# Altium schematic sheet RaspberryPi.SchDoc
size A4
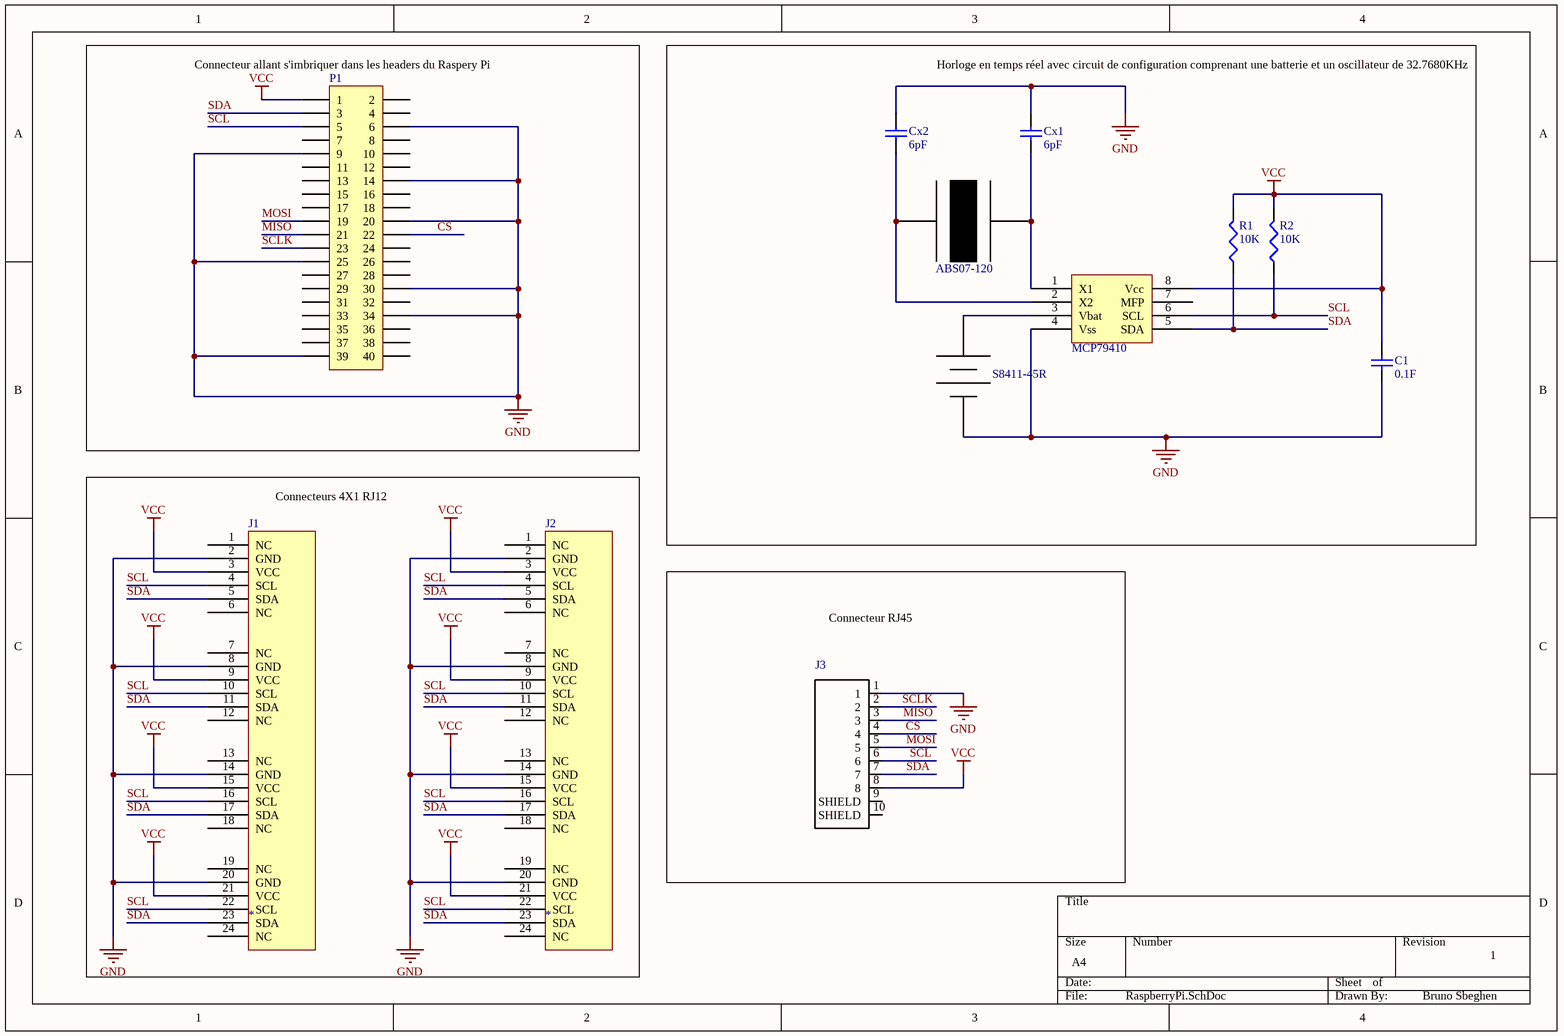
[diagram p0: RaspberryPi.SchDoc]

## Parts
ABS07-120  *  [ECX-31B]  (value not drawn)
C1  value 0.1F  [C0805]  (hidden comment: Cap 0.1uF)
Cx1  value 6pF  [C0805]  (hidden comment: Cap 6pF)
Cx2  value 6pF  [C0805]  (hidden comment: Cap 6pF)
J1  *  [TM2RE-2424]
J2  *  [TM2RE-2424]
J3  RJ45-8N-B  [TE_RJ45-8N-B]  (value not drawn)
MCP79410  *  [MCP79410]  (value not drawn)
P1  Header 20X2  [HDR2X20]  (value not drawn)
R1  value 10K  [6-0805_N]  (hidden comment: Res 10K)
R2  value 10K  [6-0805_N]  (hidden comment: Res 10K)
S8411-45R  *  [S8411-45R]  (value not drawn)

## Blocks framed on the sheet
Connecteur allant s'imbriquer dans les headers du Raspery Pi: P1
Connecteurs 4X1 RJ12: J1 J2
Connecteur RJ45: J3

## Nets
GND: C1.1 Cx1.2 Cx2.2 J1.2(GND) J1.8(GND) J1.14(GND) J1.20(GND) J2.2(GND) J2.8(GND) J2.14(GND) J2.20(GND) J3.1 MCP79410.4(Vss) P1.6 P1.9 P1.14 P1.20 P1.25 P1.30 P1.34 P1.39 S8411-45R.1
VCC: C1.2 J1.3(VCC) J1.9(VCC) J1.15(VCC) J1.21(VCC) J2.3(VCC) J2.9(VCC) J2.15(VCC) J2.21(VCC) J3.8 MCP79410.8(Vcc) P1.1 R1.2 R2.2
CS: J3.4 P1.22
MISO: J3.3 P1.21
MOSI: J3.5 P1.19
SCL: J1.4(SCL) J1.10(SCL) J1.16(SCL) J1.22(SCL) J2.4(SCL) J2.10(SCL) J2.16(SCL) J2.22(SCL) J3.6 MCP79410.6(SCL) P1.5 R2.1
SCLK: J3.2 P1.23
SDA: J1.5(SDA) J1.11(SDA) J1.17(SDA) J1.23(SDA) J2.5(SDA) J2.11(SDA) J2.17(SDA) J2.23(SDA) J3.7 MCP79410.5(SDA) P1.3 R1.1
NetABS07-120_1: ABS07-120.1 Cx2.1 MCP79410.2(X2)
NetABS07-120_2: ABS07-120.2 Cx1.1 MCP79410.1(X1)
NetMCP79410_3: MCP79410.3(Vbat) S8411-45R.2

Not connected (* = marked no-connect by the designer): J1 1(NC) 6(NC) 7(NC) 12(NC) 13(NC) 18(NC) 19(NC) 24(NC); J2 1(NC) 6(NC) 7(NC) 12(NC) 13(NC) 18(NC) 19(NC) 24(NC); J3 9(SHIELD) 10(SHIELD); MCP79410 7(MFP); P1 2 4 7 8 10 11 12 13 15 16 17 18 24 26 27 28 29 31 32 33 35 36 37 38 40

## Notes on the sheet
- Horloge en temps réel avec circuit de configuration comprenant une batterie et un oscillateur de 32.7680KHz
- 1
- Bruno Sbeghen

## Library data of the parts
ABS07-120 = AB38T: Oscillator 32.7680KHz; Supplier 1: Digi-Key; Supplier Part Number 1: 535-11937-1-ND
C1 = Cap 0.1uF: Capacitor 0.1uF; Published: 8-Jun-2000; LatestRevisionDate: 29-May-2009; LatestRevisionNote: IPC-7351 Footprint Added.; PackageReference: C1206; Publisher: Altium Limited; PackageDescription: Chip Capacitor; Supplier 1: Digi-Key; Supplier Part Number 1: 478-1395-1-ND
Cx1 Cx2 = Cap 6pF: Capacitor 6pF; Published: 8-Jun-2000; LatestRevisionDate: 29-May-2009; LatestRevisionNote: IPC-7351 Footprint Added.; PackageReference: C1206; Publisher: Altium Limited; PackageDescription: Chip Capacitor; Supplier 1: Digi-Key; Supplier Part Number 1: 1276-1767-1-ND
J1 J2 = TM2RE-2424(50): Connector MOD JACK 4pos; Supplier 1: Digi-Key; Supplier Part Number 1: H11267-ND
J3 = RJ45-8N-B: Corcom; Filter; Signal Line; Modular; 8 Contacts; 1 Port Through Hole; MF: TE Connectivity; SnapEDA_Link: https://www.snapeda.com/parts/RJ45-8N-B/TE%2520Connectivity%2520Corcom%2520Filters/view-part/?ref=snap; Price: 5.65 USD; Package: None; MP: RJ45-8N-B; Availability: Good; Value: *; Supplier 1: Digi-Key; Supplier Part Number 1: CCM1500-ND
MCP79410 = MCP79410: RTC; Supplier 1: Digi-Key; Supplier Part Number 1: MCP79410T-I/SNCT-ND
P1 = Header 20X2: Header, 20-Pin, Dual row; LatestRevisionDate: 17-Jul-2002; LatestRevisionNote: Re-released for DXP Platform.; Publisher: Altium Limited; Supplier 1: Digi-Key; Supplier Part Number 1: 609-3766-ND
R1 R2 = Res 10K: Resistor 10K; Published: 8-Jun-2000; LatestRevisionDate: 29-May-2009; LatestRevisionNote: IPC-7351 Footprint Added.; PackageReference: J1-0603; Publisher: Altium Limited; PackageDescription: Chip Resistor; Supplier 1: Digi-Key; Supplier Part Number 1: 311-10.0KCRCT-ND
S8411-45R = S8411-45R: 12mm Battery holder; Supplier 1: Digi-Key; Supplier Part Number 1: 952-1745-1-ND